# Altium schematic sheet PneumatikaDriveSema.SchDoc
size A
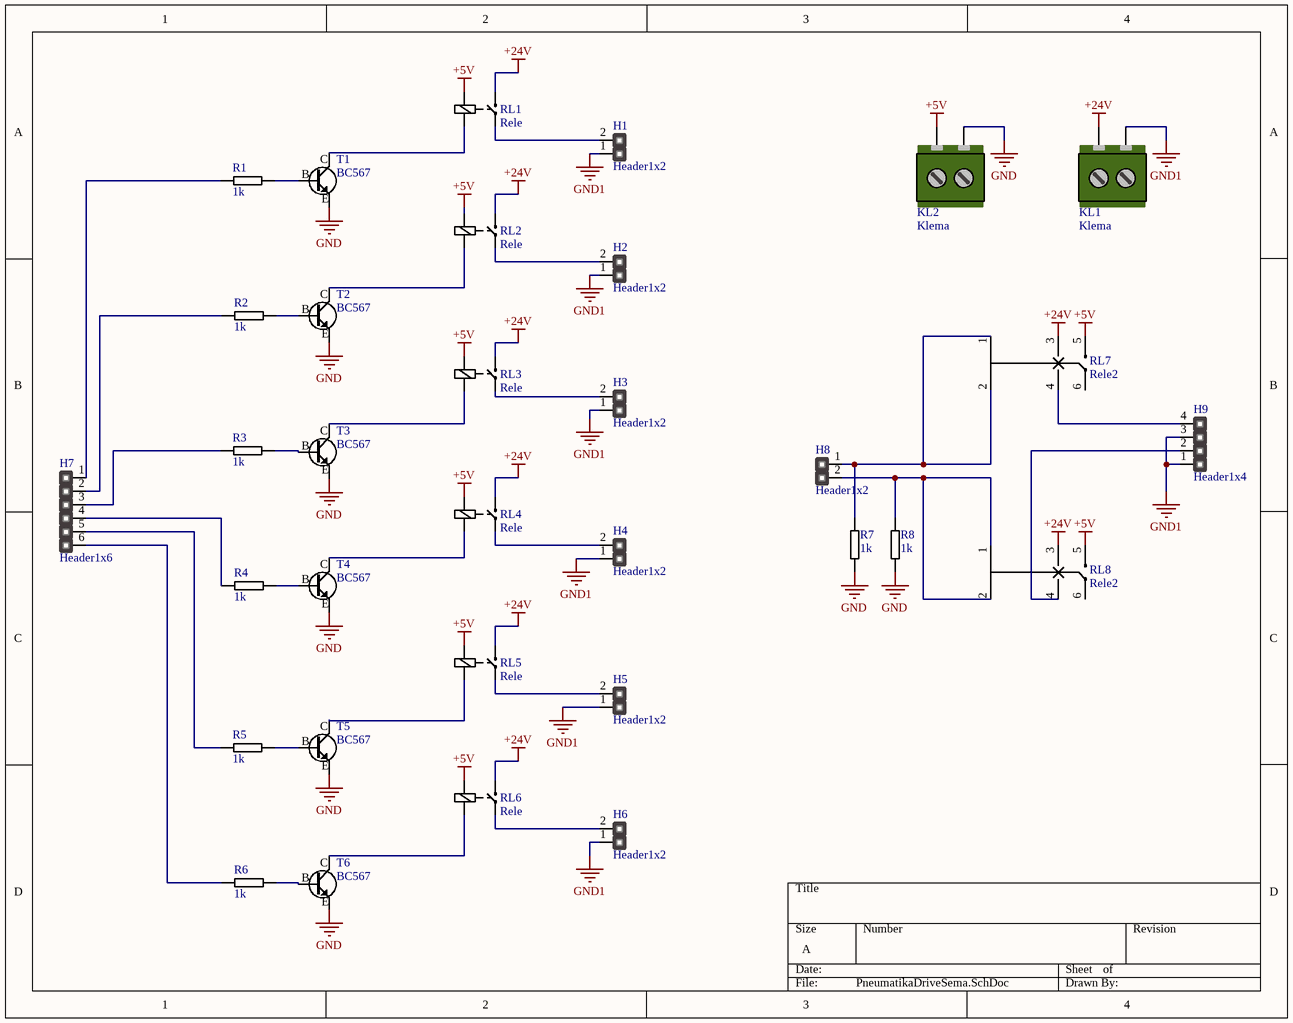
[diagram p0: PneumatikaDriveSema.SchDoc]

## Parts
H1  Header1x2  [Header1x2]
H2  Header1x2  [Header1x2]
H3  Header1x2  [Header1x2]
H4  Header1x2  [Header1x2]
H5  Header1x2  [Header1x2]
H6  Header1x2  [Header1x2]
H7  Header1x6  [Header1x6]
H8  Header1x2  [Header1x2]
H9  Header1x4  [Header1x4]
KL1  Klema  [Klema]
KL2  Klema  [Klema]
R1  1k  [R1(300milsa)]
R2  1k  [R1(300milsa)]
R3  1k  [R1(300milsa)]
R4  1k  [R1(300milsa)]
R5  1k  [R1(300milsa)]
R6  1k  [R1(300milsa)]
R7  1k  [R1(300milsa)]
R8  1k  [R1(300milsa)]
RL1  Rele  [Rele(MD-5)]
RL2  Rele  [Rele(MD-5)]
RL3  Rele  [Rele(MD-5)]
RL4  Rele  [Rele(MD-5)]
RL5  Rele  [Rele(MD-5)]
RL6  Rele  [Rele(MD-5)]
RL7  Rele2  [Rele(thu 24-03)]
RL8  Rele2  [Rele(thu 24-03)]
T1  BC567  [TO-92]
T2  BC567  [TO-92]
T3  BC567  [TO-92]
T4  BC567  [TO-92]
T5  BC567  [TO-92]
T6  BC567  [TO-92]

## Nets
+5V: KL2.2 RL1.2 RL2.2 RL3.2 RL4.2 RL5.2 RL6.2 RL7.5 RL8.5
+24V: KL1.2 RL1.4 RL2.4 RL3.4 RL4.4 RL5.4 RL6.4 RL7.3 RL8.3
GND: KL2.1 R7.1 R8.1 T1.2 T2.2 T3.2 T4.2 T5.2
GND1: H1.1 H2.1 H3.1 H4.1 H5.1 H6.1 H9.1 H9.3 KL1.1
NetH1_2: H1.2 RL1.3
NetH2_2: H2.2 RL2.3
NetH3_2: H3.2 RL3.3
NetH4_2: H4.2 RL4.3
NetH5_2: H5.2 RL5.3
NetH6_2: H6.2 RL6.3
NetH7_1: H7.1 R1.1
NetH7_2: H7.2 R2.1
NetH7_3: H7.3 R3.1
NetH7_4: H7.4 R4.1
NetH7_5: H7.5 R5.1
NetH7_6: H7.6 R6.1
NetH8_1: H8.1 R7.2 RL7.1 RL7.2
NetH8_2: H8.2 R8.2 RL8.1 RL8.2
NetH9_2: H9.2 RL8.4
NetH9_4: H9.4 RL7.4
NetR1_2: R1.2 T1.1
NetR2_2: R2.2 T2.1
NetR3_2: R3.2 T3.1
NetR4_2: R4.2 T4.1
NetR5_2: R5.2 T5.1
NetR6_2: R6.2 T6.1
NetRL1_1: RL1.1 T1.3
NetRL2_1: RL2.1 T2.3
NetRL3_1: RL3.1 T3.3
NetRL4_1: RL4.1 T4.3
NetRL5_1: RL5.1 T5.3
NetRL6_1: RL6.1 T6.3

Not connected (* = marked no-connect by the designer): RL7 6; RL8 6; T6 2

## Notes on the sheet
- Labels drawn without touching a wire or pin: GND
- (in symbol Transistor NPN) C; B; E

## Library data of the parts
R1-R8 = R1
T1-T6 = Transistor NPN